# EAGLE schematic IR_emitter_perf (EAGLE 8.6.0)
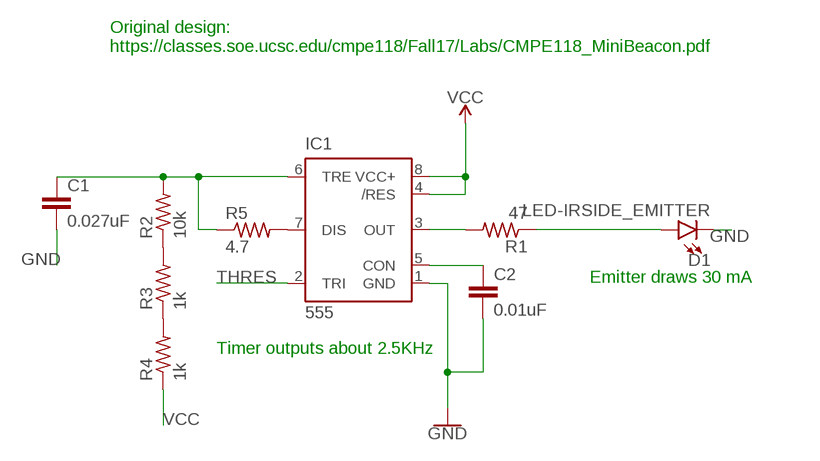
[diagram p0: schematic, sheet 1]

## Parts
C1  0.027uF  C-EU025-024X044  [C025-024X044]
C2  0.01uF  C-EU025-024X044  [C025-024X044]
D1  LED-IRSIDE_EMITTER  [LTE-302]
IC1  555  555P  [DIP08]
R1  47  R-US_0204/2V  [0204V]
R2  10k  R-US_0204/2V  [0204V]
R3  1k  R-US_0204/2V  [0204V]
R4  1k  R-US_0204/2V  [0204V]
R5  4.7  R-US_0204/2V  [0204V]

## Nets
GND: C1.2 C2.2 D1.C IC1.1(GND)
N$1: IC1.3(OUT) R1.2
N$2: D1.A R1.1
N$3: C2.1 IC1.5(CON)
N$5: IC1.7(DIS) R5.2
N$7: R2.1 R3.2
N$8: R3.1 R4.2
THRES: C1.1 IC1.2(TRI) IC1.6(TRE) R2.2 R5.1
VCC: IC1.4(/RES) IC1.8(VCC+) R4.1

## Notes on the sheet
- Original design: 
  https://classes.soe.ucsc.edu/cmpe118/Fall17/Labs/CMPE118_MiniBeacon.pdf
- Emitter draws 30 mA
- Timer outputs about 2.5KHz

## Library data of the parts
C1 C2 = resistor:C-EU: CAPACITOR, European symbol
D1 = SparkFun-LED:LED-IR: Infrared LED (IR) Wavelength: 940nm Packages: TSAL6100 LTE302 - Side firing. Check SparkFun-Sensors.lbr for the receiver SparkFun Products: ZX Distance and Gesture Sensor <[https://www.sparkfun.com/products/12780]> Infrared Emitters and Detectors <https://www.sparkfun.com/products/241>; PROD_ID: DIO-10904; SF_ID: SEN-00241
IC1 = SparkFun-IC-Special-Function:555: General purpose bipolar Timer Datasheet <http://www.sparkfun.com/datasheets/Components/General/ne555.pdf> SparkFun Products SparkFun SparkPunk Sequencer Kit <https://www.sparkfun.com/products/12707> (KIT-12707) Storefront Component: 555 Timer <https://www.sparkfun.com/products/9273> (COM-09273) Two parts valid for production: VFP: IC-11930 (M7555 PTH) VFP: IC-09173 (555 PTH) - Preferred; PROD_ID: IC-09173; PROD_ID_ALT: IC-09173
R1-R5 = resistor:R-US_: RESISTOR, American symbol